# EAGLE design lipovsky-power (EAGLE 7.7.0)
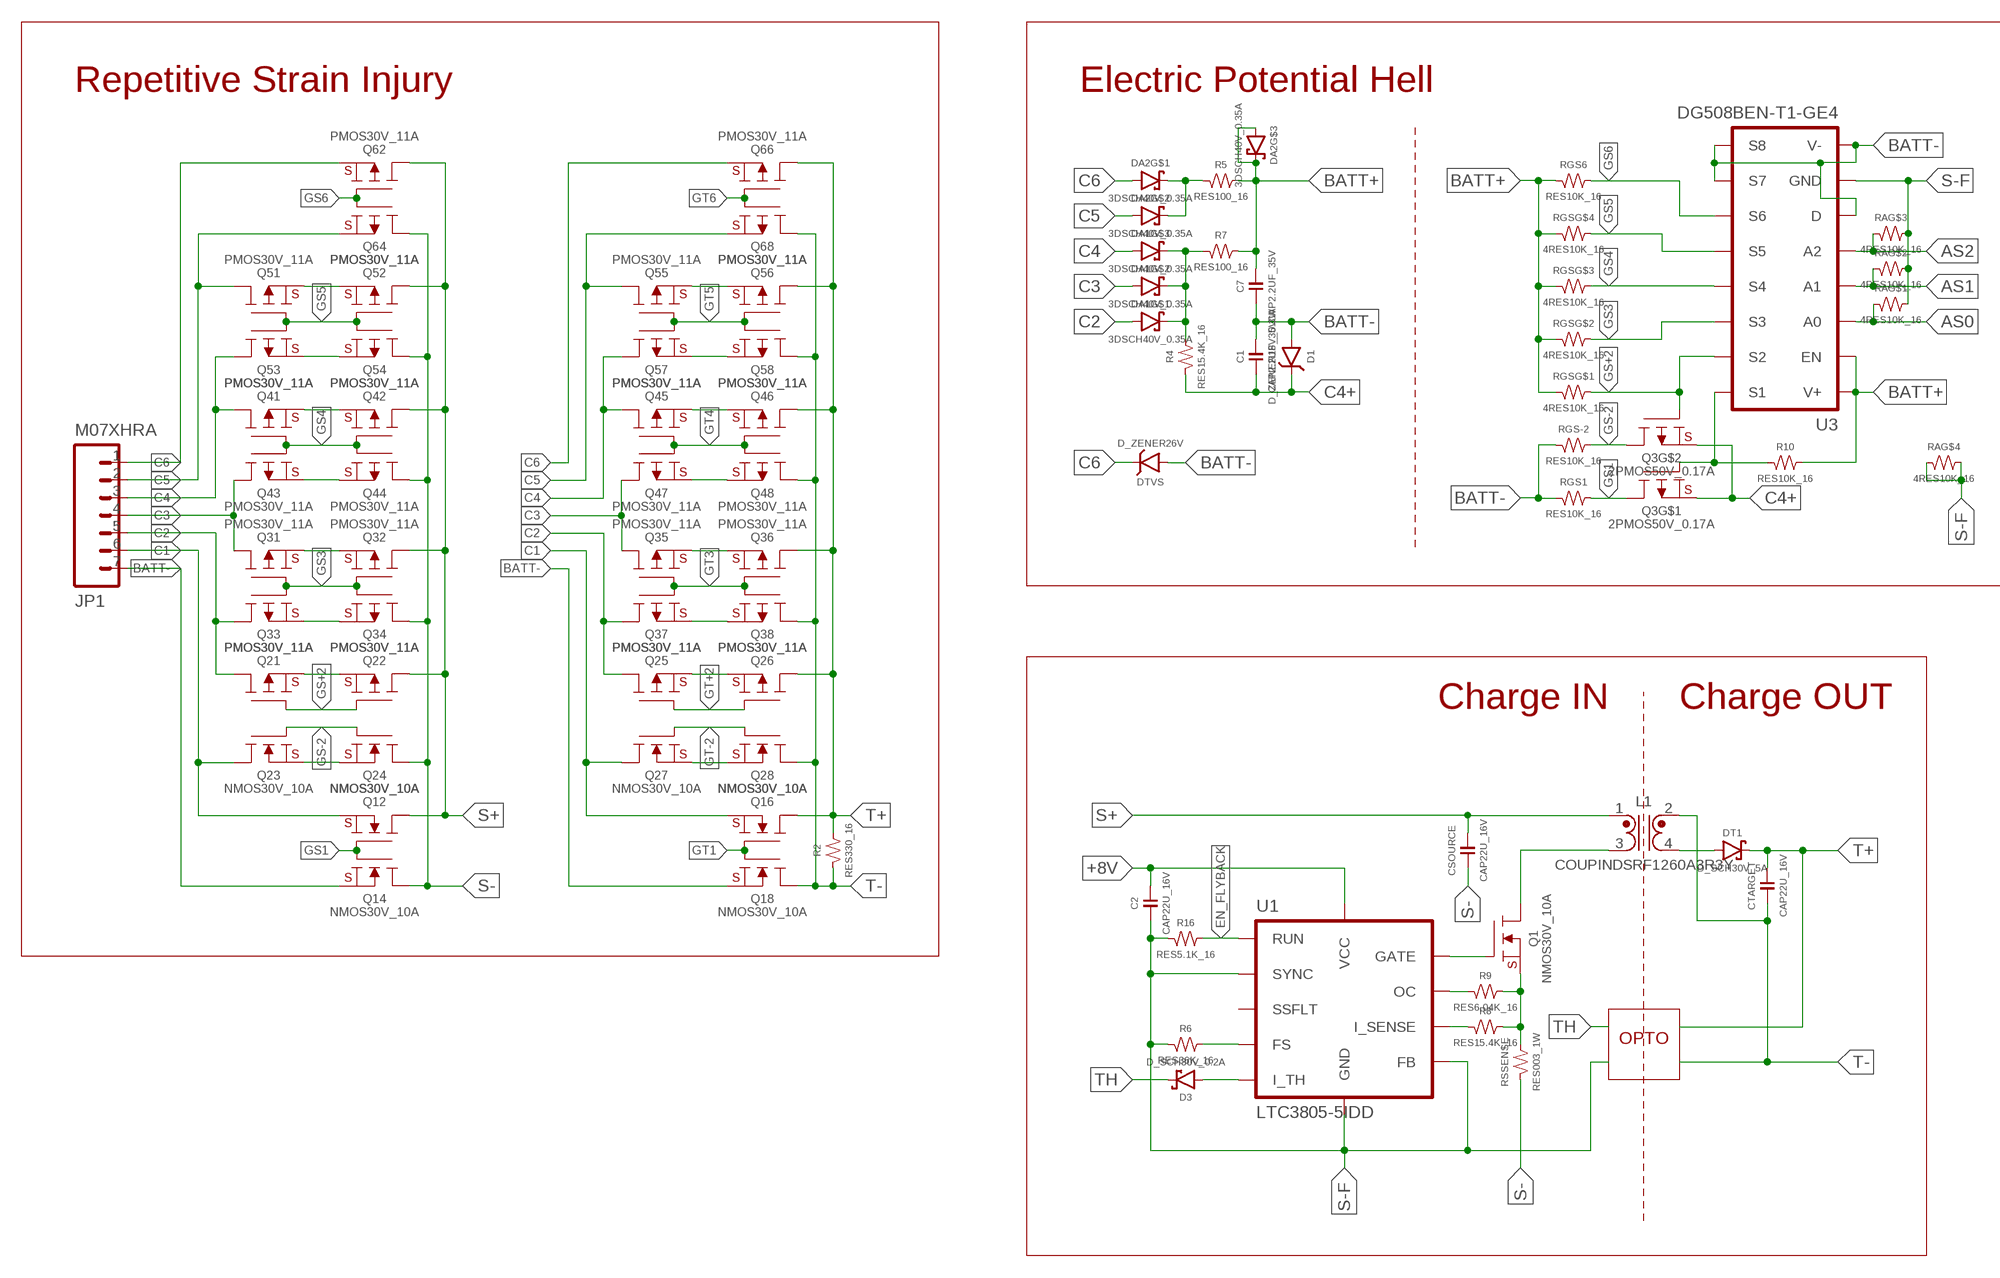
[diagram p0: schematic, sheet 1, part 1 of 2]
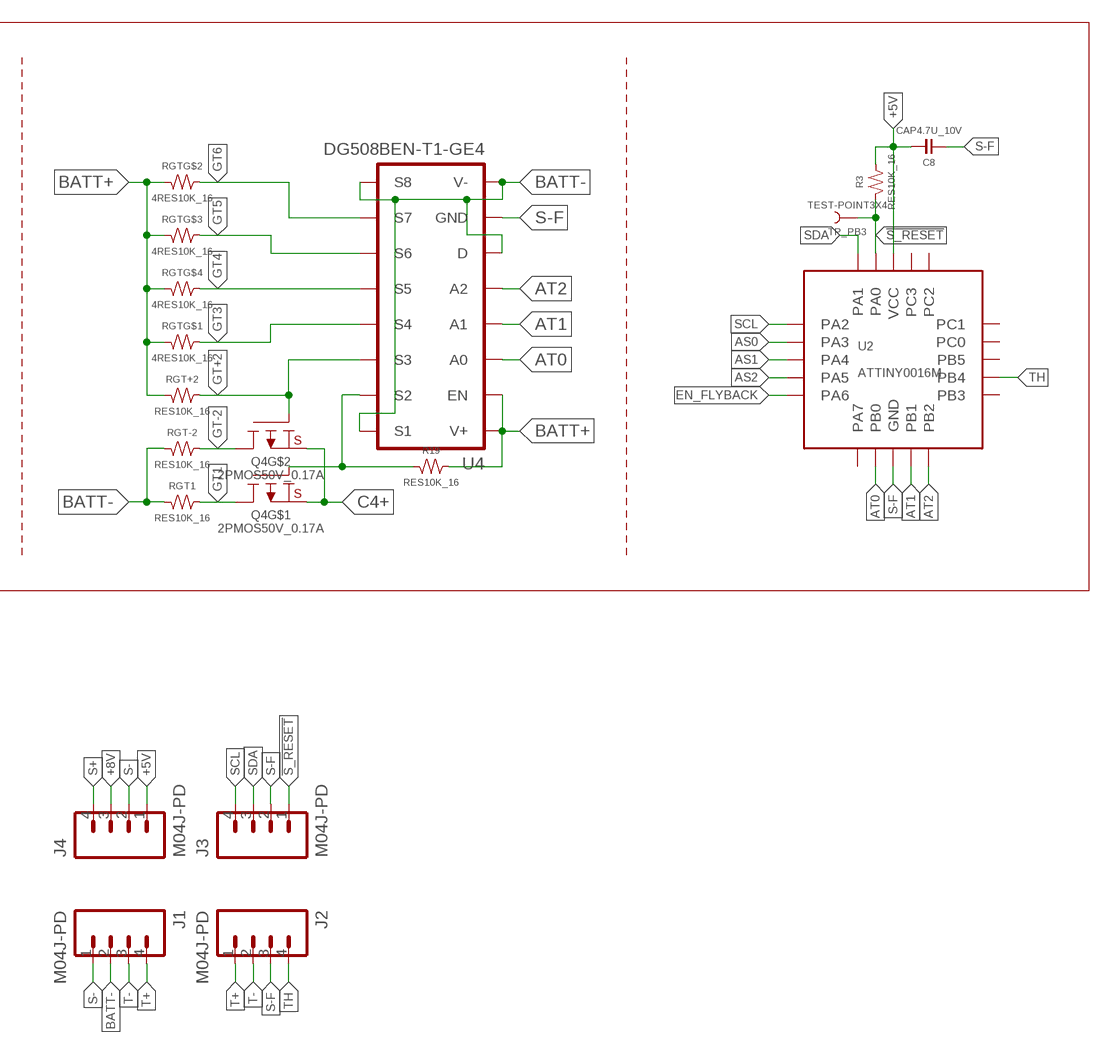
[diagram p1: schematic, sheet 1, part 2 of 2]

## Parts
C1  CAP2.2UF_35V  [0402]
C2  CAP22U_16V  [0805]
C7  CAP2.2UF_35V  [0402]
C8  CAP4.7U_10V  [0603]
CSOURCE  CAP22U_16V  [0805]
CTARGET  CAP22U_16V  [0805]
D1  D_ZENER18V_0.3W  [SOD323+]
D3  D_SCH30V_0.2A  [SOD523+]
DA1  3DSCH40V_0.35A  [SOT-363]
DA2  3DSCH40V_0.35A  [SOT-363]
DT1  D_SCH30V_5A  [SOD-128]
DTVS  D_ZENER26V  [2-UDFN]
J1  M04J-PD  [1X04_929J]
J2  M04J-PD  [1X04_929J]
J3  M04J-PD  [1X04_929J]
J4  M04J-PD  [1X04_929J]
JP1  M07XHRA  [XH07-RA]
L1  COUPINDSRF1260A3R3Y  [SRF1260A]
Q1  NMOS30V_10A  [6-POWERWDFN]
Q3  2PMOS50V_0.17A  [SOT-666]
Q4  2PMOS50V_0.17A  [SOT-666]
Q12  NMOS30V_10A  [6-POWERWDFN]
Q14  NMOS30V_10A  [6-POWERWDFN]
Q16  NMOS30V_10A  [6-POWERWDFN]
Q18  NMOS30V_10A  [6-POWERWDFN]
Q21  PMOS30V_11A  [6-POWERWDFN]
Q22  PMOS30V_11A  [6-POWERWDFN]
Q23  NMOS30V_10A  [6-POWERWDFN]
Q24  NMOS30V_10A  [6-POWERWDFN]
Q25  PMOS30V_11A  [6-POWERWDFN]
Q26  PMOS30V_11A  [6-POWERWDFN]
Q27  NMOS30V_10A  [6-POWERWDFN]
Q28  NMOS30V_10A  [6-POWERWDFN]
Q31  PMOS30V_11A  [6-POWERWDFN]
Q32  PMOS30V_11A  [6-POWERWDFN]
Q33  PMOS30V_11A  [6-POWERWDFN]
Q34  PMOS30V_11A  [6-POWERWDFN]
Q35  PMOS30V_11A  [6-POWERWDFN]
Q36  PMOS30V_11A  [6-POWERWDFN]
Q37  PMOS30V_11A  [6-POWERWDFN]
Q38  PMOS30V_11A  [6-POWERWDFN]
Q41  PMOS30V_11A  [6-POWERWDFN]
Q42  PMOS30V_11A  [6-POWERWDFN]
Q43  PMOS30V_11A  [6-POWERWDFN]
Q44  PMOS30V_11A  [6-POWERWDFN]
Q45  PMOS30V_11A  [6-POWERWDFN]
Q46  PMOS30V_11A  [6-POWERWDFN]
Q47  PMOS30V_11A  [6-POWERWDFN]
Q48  PMOS30V_11A  [6-POWERWDFN]
Q51  PMOS30V_11A  [6-POWERWDFN]
Q52  PMOS30V_11A  [6-POWERWDFN]
Q53  PMOS30V_11A  [6-POWERWDFN]
Q54  PMOS30V_11A  [6-POWERWDFN]
Q55  PMOS30V_11A  [6-POWERWDFN]
Q56  PMOS30V_11A  [6-POWERWDFN]
Q57  PMOS30V_11A  [6-POWERWDFN]
Q58  PMOS30V_11A  [6-POWERWDFN]
Q62  PMOS30V_11A  [6-POWERWDFN]
Q64  PMOS30V_11A  [6-POWERWDFN]
Q66  PMOS30V_11A  [6-POWERWDFN]
Q68  PMOS30V_11A  [6-POWERWDFN]
R2  RES330_16  [0402]
R3  RES10K_16  [0402]
R4  RES15.4K_16  [0402]
R5  RES100_16  [0402]
R6  RES36K_16  [0402]
R7  RES100_16  [0402]
R8  RES15.4K_16  [0402]
R9  RES6.04K_16  [0402]
R10  RES10K_16  [0402]
R16  RES5.1K_16  [0402]
R19  RES10K_16  [0402]
RA  4RES10K_16  [1206-QUAD-LS]
RGS  4RES10K_16  [1206-QUAD-LS]
RGS1  RES10K_16  [0402]
RGS6  RES10K_16  [0402]
RGS-2  RES10K_16  [0402]
RGT  4RES10K_16  [1206-QUAD-LS]
RGT1  RES10K_16  [0402]
RGT+2  RES10K_16  [0402]
RGT-2  RES10K_16  [0402]
RSSENSE  RES003_1W  [1206]
TP_PB3  TEST-POINT3X4  [PAD.03X.04]
U1  LTC3805-5IDD  [10-WFDFN]
U2  ATTINY0016M  [20-VQFN-2]
U3  DG508BEN-T1-GE4  [MINIQFN-16L]
U4  DG508BEN-T1-GE4  [MINIQFN-16L]

## Nets
!GS1: Q3.2(G) R10.1 U3.2(S1)
!GT1: Q4.2(G) R19.1 U4.3(S2)
!S_RESET: J3.1 R3.1 TP_PB3.P$1 U2.19(PA0)
+5V: C8.2 J4.1 R3.2 U2.4(VCC)
+8V: C2.2 J4.3 U1.7(VCC)
AS0: RA.1 U2.2(PA3) U3.15(A0)
AS1: RA.2 U2.5(PA4) U3.14(A1)
AS2: RA.3 U2.6(PA5) U3.13(A2)
AT0: U2.14(PB0) U4.15(A0)
AT1: U2.13(PB1) U4.14(A1)
AT2: U2.12(PB2) U4.13(A2)
BATT+: C7.2 DA2.3(C) DA2.4(A) R5.2 R7.2 R10.2 R19.2 RGS6.1 RGS.1 RGS.2 RGS.3 RGS.4 RGT+2.1 RGT.1 RGT.2 RGT.3 RGT.4 U3.11(V+) U3.16(EN) U4.11(V+) U4.16(EN)
BATT-: C1.2 C7.1 D1.A DTVS.A J1.2 JP1.7 Q14.S Q18.S RGS1.1 RGS-2.1 RGT1.1 RGT-2.1 U3.1(V-) U3.6(D) U3.7(S8) U3.8(S7) U4.1(V-) U4.2(S1) U4.6(D) U4.7(S8)
C1: JP1.6 Q12.S Q16.S Q23.D Q27.D
C2: DA1.6(A) JP1.5 Q21.D Q25.D Q33.D Q37.D
C3: DA1.5(A) JP1.4 Q31.D Q35.D Q43.D Q47.D
C4: DA1.4(A) JP1.3 Q41.D Q45.D Q53.D Q57.D
C4+: C1.1 D1.C Q3.1(S) Q3.4(S) Q4.1(S) Q4.4(S) R4.1
C4D: DA1.1(C) DA1.2(C) DA1.3(C) R4.2 R7.1
C5: DA2.5(A) JP1.2 Q51.D Q55.D Q64.S Q68.S
C6: DA2.6(A) DTVS.C JP1.1 Q62.S Q66.S
C6D: DA2.1(C) DA2.2(C) R5.1
EN_FLYBACK: R16.2 U1.4(RUN) U2.7(PA6)
FS: R6.2 U1.5(FS)
GATE: Q1.G U1.6(GATE)
GS1: Q3.6(D) Q12.G Q14.G RGS1.2
GS3: Q31.G Q32.G Q33.G Q34.G RGS.7 U3.4(S3)
GS4: Q41.G Q42.G Q43.G Q44.G RGS.6 U3.5(S4)
GS5: Q51.G Q52.G Q53.G Q54.G RGS.5 U3.10(S5)
GS6: Q62.G Q64.G RGS6.2 U3.9(S6)
GS+2: Q3.5(G) Q21.G Q22.G RGS.8 U3.3(S2)
GS-2: Q3.3(D) Q23.G Q24.G RGS-2.2
GT1: Q4.6(D) Q16.G Q18.G RGT1.2
GT3: Q35.G Q36.G Q37.G Q38.G RGT.8 U4.5(S4)
GT4: Q45.G Q46.G Q47.G Q48.G RGT.5 U4.10(S5)
GT5: Q55.G Q56.G Q57.G Q58.G RGT.6 U4.9(S6)
GT6: Q66.G Q68.G RGT.7 U4.8(S7)
GT+2: Q4.5(G) Q25.G Q26.G RGT+2.2 U4.4(S3)
GT-2: Q4.3(D) Q27.G Q28.G RGT-2.2
I_SENSE: R8.1 U1.9(I_SENSE)
I_TH: D3.A U1.2(I_TH)
N$7: DT1.A L1.4(B2)
N$10: L1.3(A2) Q1.D
OC: R9.1 U1.8(OC)
S+: CSOURCE.2 J4.4 L1.1(A1) Q12.D Q22.D Q32.D Q42.D Q52.D Q62.D
S-: CSOURCE.1 J1.1 J4.2 Q14.D Q24.D Q34.D Q44.D Q54.D Q64.D RSSENSE.1
S-F: C2.1 C8.1 J2.3 J3.2 R6.1 R16.1 RA.4 RA.5 RA.6 RA.7 RA.8 U1.3(FB) U1.10(SYNC) U1.PAD(GND) U2.3(GND) U2.PAD(GND) U3.12(GND) U4.12(GND)
SCL: J3.4 U2.1(PA2)
SDA: J3.3 U2.20(PA1)
SENSE: Q1.S R8.2 R9.2 RSSENSE.2
SS+2: Q21.S Q22.S
SS+3: Q31.S Q32.S
SS+4: Q41.S Q42.S
SS+5: Q51.S Q52.S
SS-2: Q23.S Q24.S
SS-3: Q33.S Q34.S
SS-4: Q43.S Q44.S
SS-5: Q53.S Q54.S
ST+2: Q25.S Q26.S
ST+3: Q35.S Q36.S
ST+4: Q45.S Q46.S
ST+5: Q55.S Q56.S
ST-2: Q27.S Q28.S
ST-3: Q37.S Q38.S
ST-4: Q47.S Q48.S
ST-5: Q57.S Q58.S
T+: CTARGET.2 DT1.C J1.4 J2.1 Q16.D Q26.D Q36.D Q46.D Q56.D Q66.D R2.2
T-: CTARGET.1 J1.3 J2.2 L1.2(B1) Q18.D Q28.D Q38.D Q48.D Q58.D Q68.D R2.1
TH: D3.C J2.4 U2.10(PB4)
Unconnected: U1.1(SSFLT) U2.8(PA7) U2.9(PB5) U2.11(PB3) U2.15(PC0) U2.16(PC1) U2.17(PC2) U2.18(PC3)

## Notes on the sheet
- Repetitive Strain Injury | Electric Potential Hell
- Charge IN | Charge OUT
- OPTO

## Library data of the parts
C1 C7 = dubec:CAP: Ceramic capacitor; DIGIKEY_PART_#: 445-9028-1-ND; EURO: 12.88/100; MANUFACTURER: TDK Corporation; MFG_PART_#: C1005X5R1V225K050BC; TEMP: X5R; TOLERANCE: ±10%
C2 CSOURCE CTARGET = dubec:CAP: Ceramic capacitor; DIGIKEY_PART_#: 1276-6780-1-ND; EURO: 8.45/100; MANUFACTURER: Samsung Electro-Mechanics America, Inc.; MFG_PART_#: CL21A226MOCLRNC; TEMP: X5R; TOLERANCE: ±20%
C8 = dubec:CAP: Ceramic capacitor; DIGIKEY_PART_#: 587-1441-1-ND; EPK: 29.92; MANUFACTURER: Taiyo Yuden; MFG_PART_#: LMK107BJ475KA-T; TEMP: X5R
D1 = dubec:D_ZENER: Zener diode; DIGIKEY_PART_#: MM3Z18VT1GOSCT-ND; IR: 50nA @ 12.6V; MANUFACTURER: ON Semiconductor; MFG_PART_#: MM3Z18VT1G; TOLERANCE: ±6%; Z: 45 Ohm
D3 = dubec:D_SCH: Schottky diode; DIGIKEY_PART_#: RB531SM-30T2RCT-ND; EURO: 8.89/100; MANUFACTURER: Rohm Semiconductor; MFG_PART_#: RB531SM-30T2R; V_FWD: 350mV @ 10mA
DA1 DA2 = dubec:3DSCH; DIGIKEY_PART_#: SD103ATW-FDICT-ND; EPK: 87.43; MANUFACTURER: Diodes Incorporated; MFG_PART_#: SD103ATW-7-F; VF: 500mV @ 100mA
DT1 = dubec:D_SCH: Schottky diode; DIGIKEY_PART_#: 1727-5317-1-ND; EURO: 27.25/100; IREV: 8mA @ 30V; MANUFACTURER: Nexperia USA Inc.; MFG_PART_#: PMEG3050EP,115; VFWD: 360mV @ 5A
DTVS = dubec:D_ZENER: Zener diode; DIGIKEY_PART_#: D26V0H1U2LP20-7DICT-ND; EURO: 20.16/100; MANUFACTURER: Diodes Incorporated; MFG_PART_#: D26V0H1U2LP20-7; PP: 300W; V_BRDN: 28V; V_CLAMP: 40V
J1-J4 = dubec:M04; DIGIKEY_PART_#: 801-87-004-10-012101-ND; EURO: 23.70/100; MANUFACTURER: Preci-Dip; MFG_PART_#: 801-87-004-10-012101; MOUSER_PART_#: 437-8018700410012101
JP1 = dubec:M07; DIGIKEY_PART_#: 455-2240-ND; EPK: 190.44; MANUFACTURER: JST Sales America Inc.; MFG_PART_#: S7B-XH-A(LF)(SN)
L1 = dubec:COUPIND: Dual-Winding (Coupled) Power Inductor; DIGIKEY_PART_#: SRF1260A-3R3YCT-ND; EURO: 1.07; LPAR: 3.3uH; MANUFACTURER: Bourns Inc.; MFG_PART_#: SRF1260A-3R3Y; RPAR: 10.1mOhm; TOLERANCE: ±30%
Q1 Q12 Q14 Q16 Q18 Q23 Q24 Q27 Q28 = dubec:NMOS: N-channel MOSFET; DIGIKEY_PART_#: FDMA7670CT-ND; EPK: 231.24; MANUFACTURER: Fairchild Semiconductor; MFG_PART_#: FDMA7670; POWER: 0.9W; RDS: 15 mOhm @ 11A, 10V
Q3 Q4 = dubec:2PMOS: Dual P-channel enhancement mode MOSFET; DIGIKEY_PART_#: 568-10474-1-ND; EPK: 103.10; MANUFACTURER: NXP Semiconductors; MFG_PART_#: BSS84AKV,115; POWER: 0.5W; RDS: 7.5 Ohm @ 100mA, 10V; TEMP: -55°C ~ 150°C (TJ)
Q21 Q22 Q25 Q26 Q31-Q38 Q41-Q48 Q51-Q58 Q62 Q64 Q66 Q68 = dubec:PMOS: Single P-Channel MOSFET; ALTERNATIVE: SIA483DJ-T1-GE3; DIGIKEY_PART_#: FDMA6676PZCT-ND; EPK: 316.51; MANUFACTURER: Fairchild Semiconductor; MFG_PART_#: FDMA6676PZ; POWER: 0.9W; RDS: 13.5 mOhm @ 11A, 10V
R2 = dubec:RES: Resistor; DIGIKEY_PART_#: 541-330LCT-ND; EPK: 5.24; MANUFACTURER: Vishay Dale; MFG_PART_#: CRCW0402330RFKED; TEMP: ±100ppm/°C; TOLERANCE: ±1%
R3 R10 R19 RGS1 RGS6 RGS-2 RGT1 RGT+2 RGT-2 = dubec:RES: Resistor; DIGIKEY_PART_#: 541-10.0KLCT-ND; EPK: 5.24; MANUFACTURER: Vishay Dale; MFG_PART_#: CRCW040210K0FKED; TEMP: ±100ppm/°C; TOLERANCE: ±1%
R4 R8 = dubec:RES: Resistor; DIGIKEY_PART_#: 541-15.4KLCT-ND; EPK: 5.24; MANUFACTURER: Vishay Dale; MFG_PART_#: CRCW040215K4FKED; TEMP: ±100ppm/°C; TOLERANCE: ±1%
R5 R7 = dubec:RES: Resistor; DIGIKEY_PART_#: 541-100LCT-ND; EURO: 2.01/50; MANUFACTURER: Vishay Dale; MFG_PART_#: CRCW0402100RFKED; TEMP: ±100ppm/°C; TOLERANCE: ±1%
R6 = dubec:RES: Resistor; DIGIKEY_PART_#: 541-36.0KLCT-ND; EURO: 5.69/1000; MANUFACTURER: Vishay Dale; MFG_PART_#: CRCW040236K0FKED; TEMP: ±100ppm/°C; TOLERANCE: ±1%
R9 = dubec:RES: Resistor; DIGIKEY_PART_#: 541-6.04KLCT-ND; EPK: 5.24; MANUFACTURER: Vishay Dale; MFG_PART_#: CRCW04026K04FKED; TEMP: ±100ppm/°C; TOLERANCE: ±1%
R16 = dubec:RES: Resistor; DIGIKEY_PART_#: 541-5.10KLCT-ND; EPK: 5.24; MANUFACTURER: Vishay Dale; MFG_PART_#: CRCW04025K10FKED; TEMP: ±100ppm/°C; TOLERANCE: ±1%
RA RGS RGT = dubec:4RES; DIGIKEY_PART_#: Y9103CT-ND; EPK: 11.22; MANUFACTURER: Panasonic Electronic Components; MFG_PART_#: EXB-38V103JV; TEMP: ±200ppm/°C; TOLERANCE: ±5%
RSSENSE = dubec:RES: Resistor; DIGIKEY_PART_#: CSNL1206FT3L00CT-ND; EPK: 190.34; MANUFACTURER: Stackpole Electronics Inc.; MFG_PART_#: CSNL1206FT3L00; TEMP: ±50ppm/°C; TOLERANCE: ±1%
TP_PB3 = SparkFun-Passives:TEST-POINT: Bare copper test points for troubleshooting or ICT
U1 = dubec:LTC3805-5: LTC3805-5 - Adjustable Frequency Current Mode Flyback/ Boost/SEPIC DC/DC Controller; DIGIKEY_PART_#: LTC3805IDD-5#PBF-ND; EPK: 1609.00; MANUFACTURER: Linear Technology; MFG_PART_#: LTC3805IDD-5#PBF; TEMP: -40°C ~ 125°C (TJ)
U2 = dubec:ATTINY0016: AVR® 8-bit CPU; DIGIKEY_PART_#: ATTINY1616-MFRCT-ND; EEPROM: 256; EURO: 15.52/25; FLASH: 16KB; MANUFACTURER: Microchip Technology; MFG_PART_#: ATTINY1616-MFR; RAM: 2K; TEMP: -40°C ~ 125°C (TA)
U3 U4 = dubec:DG508B: Vishay Siliconix DG508B - 8-Channel CMOS Analog Multiplexer; EPK: 977.00; MANUFACTURER: Vishay Siliconix; MFG_PART_#: DG508BEN-T1-GE4; MOUSER_PART_#: 78-DG508BEN-T1-GE4; RON: 380 Ohm; TEMP: -40°C ~ 125°C (TA); VSS: ±5 V ~ 20 V

## Board
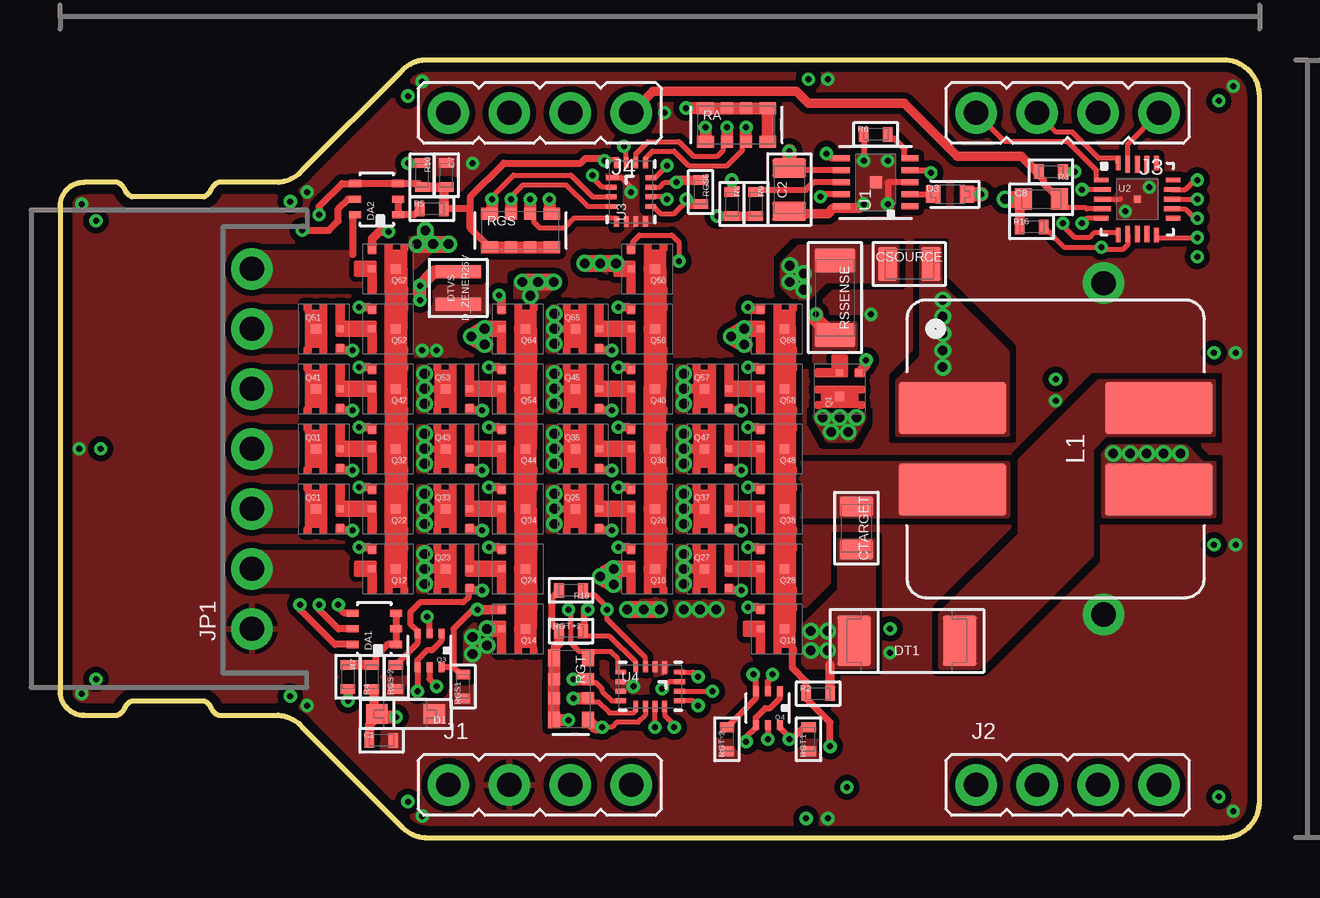
[diagram p2: board, top side]
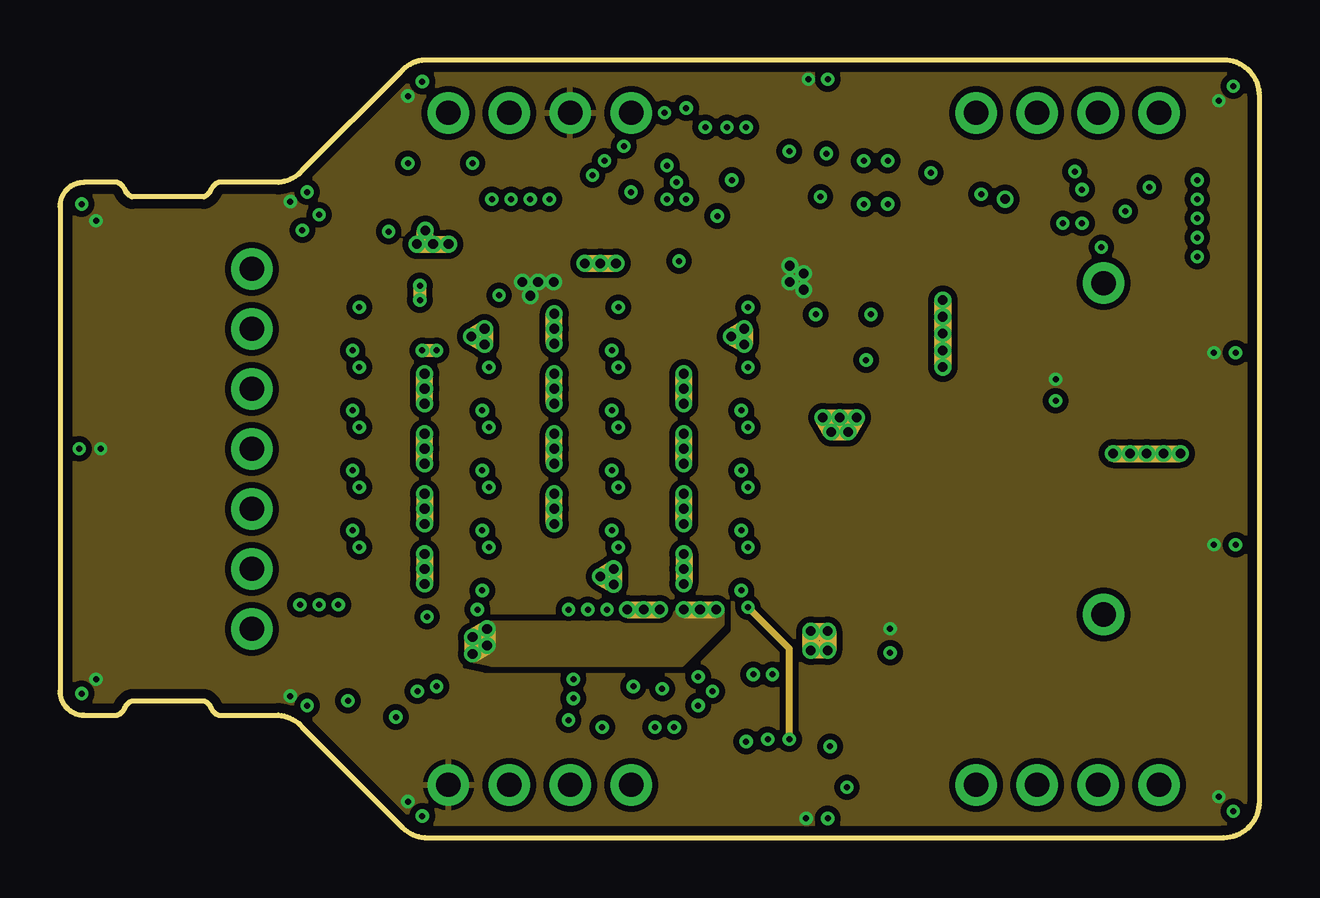
[diagram p3: board, inner layer Route2]
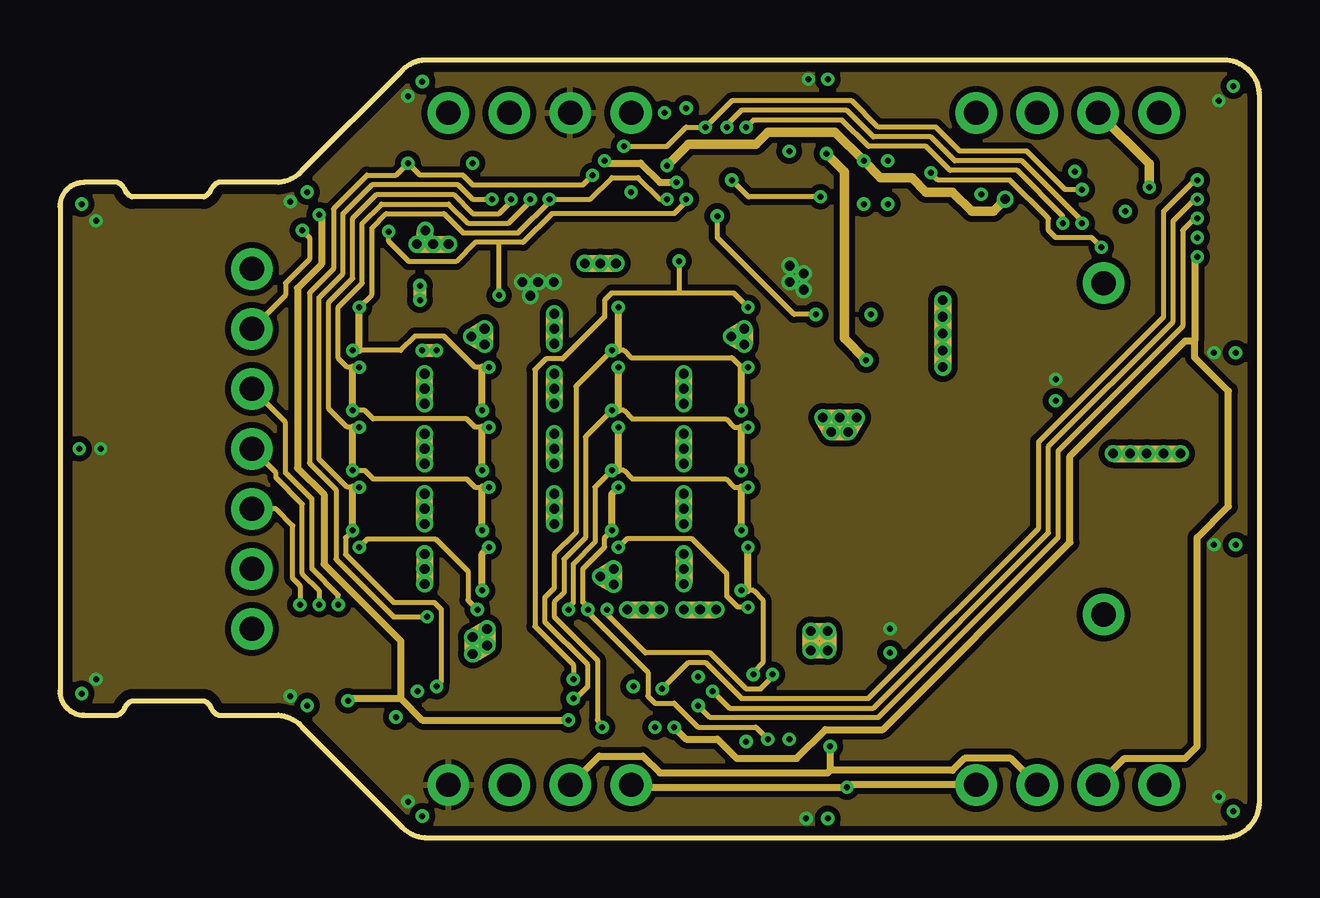
[diagram p4: board, inner layer Route15]
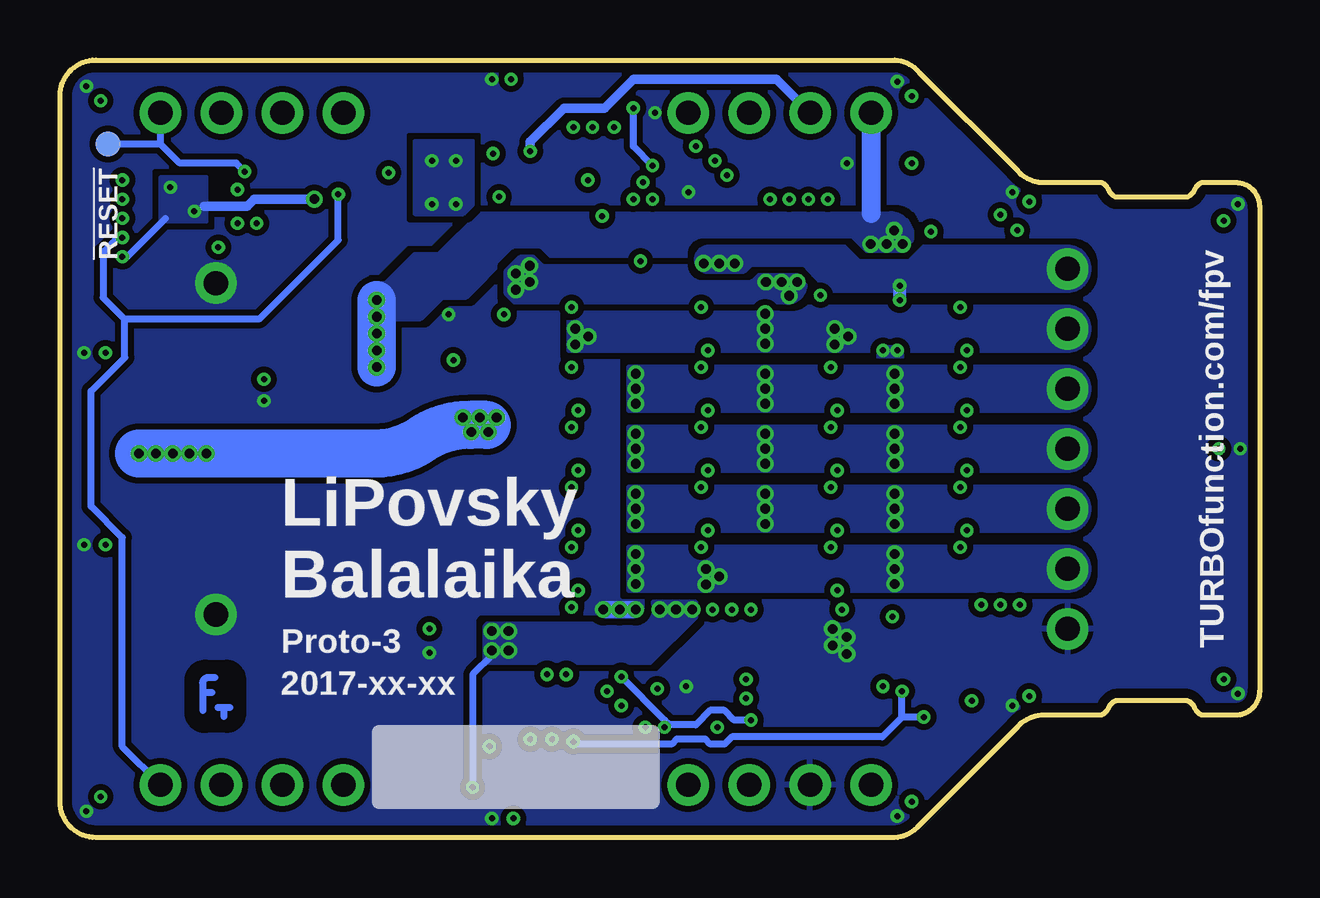
[diagram p5: board, bottom side, seen from below]

Size 50 x 32.4 mm. Coordinates in mm from the lower left corner, seen from the top.
Outline: 0,6.1 arc90 1,5.1 2.4,5.1 arc45 2.7,5.4 arc-45 3,5.7 6,5.7 arc-45 6.3,5.4 arc45 6.6,5.1 9.1,5.1 arc-45 10.1,4.6 14.2,0.5 arc45 15.2,0 48.5,0 arc90 50,1.5 50,30.9 arc90 48.5,32.4 15.2,32.4 arc45 14.2,31.9 10.1,27.8 arc-45 9.1,27.3 6.6,27.3 arc45 6.3,27 arc-45 6,26.7 3,26.7 arc-45 2.7,27 arc45 2.4,27.3 1,27.3 arc90 0,26.3 0,6.1
Copper layers (1+2*15+16): Top 1mil / dielectric 0.2mm / Route2 0.5mil / dielectric 1.2mm / Route15 0.5mil / dielectric 0.2mm / Bottom 1mil
Design rules "lipovsky-power *": minimum track width 0.15mm, minimum drill 0.25mm, track to track 0.2mm, track to pad 0.2mm, pad to pad 0.2mm, via to via 0.2mm, smd to smd 0mil, copper to edge 0.4mm, drill to drill 0.2mm, minimum pad ring 0.15mm, minimum via ring 0.15mm, stop-mask expansion 0.01mm, vias tented up to drill 0.5mm, thermal gap 0.2mm

### Footprints (pad centres in the part's own frame; a part is rotated, then mirrored left to right if it is on the bottom)
0402 = smd 0.4 x 0.6: 1 -0.5,0; 2 0.5,0
0805 = smd 0.8 x 1.4: 1 -0.9,0; 2 0.9,0
0603 = smd 0.7 x 0.9: 1 -0.75,0; 2 0.75,0
SOD323+ = smd 0.9 x 0.8: A -1.2,0; C 1.2,0
SOD523+ = smd 0.6 x 0.7: A -0.7,0; C 0.7,0
SOT-363 = smd 0.3 x 0.5: 1 -0.65,-0.9; 2 0,-0.9; 3 0.65,-0.9; 4 0.65,0.9; 5 0,0.9; 6 -0.65,0.9
SOD-128 = smd 1.4 x 2.1: A -2.2,0; C 2.2,0
2-UDFN = smd 0.55 x 1.9: A -0.675,0; C 0.675,0
1X04_929J = drill 1.016: 1 -3.81,0; 2 -1.27,0; 3 1.27,0; 4 3.81,0
XH07-RA = drill 1.016: 1 7.5,0; 2 5,0; 3 2.5,0; 4 0,0; 5 -2.5,0; 6 -5,0; 7 -7.5,0
SRF1260A = smd 2.15 x 4.5: 1 -1.7,-4.3; 2 1.7,-4.3; 3 1.7,4.3; 4 -1.7,4.3
6-POWERWDFN = smd 0.4 x 0.4: D -0.325,0 | smd 0.3 x 0.3: G 0.675,-0.8; S 0.675,0
SOT-666 = smd 0.25 x 0.4: 1 -0.5,-0.7; 2 0,-0.7; 3 0.5,-0.7; 4 0.5,0.7; 5 0,0.7; 6 -0.5,0.7
1206-QUAD-LS = smd 0.7 x 0.5: 1 -1.3,-0.7; 4 1.3,-0.7; 5 1.3,0.7; 8 -1.3,0.7 | smd 0.5 x 0.5: 2 -0.4,-0.7; 3 0.4,-0.7; 6 0.4,0.7; 7 -0.4,0.7
1206 = smd 1 x 1.7: 1 -1.55,0; 2 1.55,0
PAD.03X.04 = smd 1.016 x 1.016: P$1 0,0
10-WFDFN = smd 0.25 x 0.7: 1 -1,-1.425; 2 -0.5,-1.425; 3 0,-1.425; 4 0.5,-1.425; 5 1,-1.425; 6 1,1.425; 7 0.5,1.425; 8 0,1.425; 9 -0.5,1.425; 10 -1,1.425 | smd 0.5 x 0.5: PAD 0,0
20-VQFN-2 = smd 0.6 x 0.2: 1 -1.5,0.8; 5 -1.5,-0.8; 11 1.5,-0.8; 15 1.5,0.8 | smd 0.7 x 0.2: 2 -1.45,0.4; 3 -1.45,0; 4 -1.45,-0.4; 12 1.45,-0.4; 13 1.45,0; 14 1.45,0.4 | smd 0.2 x 0.6: 6 -0.8,-1.5; 10 0.8,-1.5; 16 0.8,1.5; 20 -0.8,1.5 | smd 0.2 x 0.7: 7 -0.4,-1.45; 8 0,-1.45; 9 0.4,-1.45; 17 0.4,1.45; 18 0,1.45; 19 -0.4,1.45 | smd 0.3 x 0.3: PAD 0,0
MINIQFN-16L = smd 0.55 x 0.2: 1 -0.775,0.6 | smd 0.45 x 0.2: 2 -0.825,0.2; 3 -0.825,-0.2; 4 -0.825,-0.6; 9 0.825,-0.6; 10 0.825,-0.2; 11 0.825,0.2; 12 0.825,0.6 | smd 0.2 x 0.45: 5 -0.6,-1.225; 6 -0.2,-1.225; 7 0.2,-1.225; 8 0.6,-1.225; 13 0.6,1.225; 14 0.2,1.225; 15 -0.2,1.225; 16 -0.6,1.225

### Placement (x,y rotation side)
ART1  [TF-EMBLEM]  43.5,5.9 0 bottom
C1  13.4,4.05 0 top
C2  30.4,27 90 top
C7  16.1,27.6 270 top
C8  40.9,26.6 0 top
CSOURCE  35.4,23.9 0 top
CTARGET  33.2,12.9 270 top
D1  14.4,5.15 180 top
D3  37.1,26.8 0 top
DA1  13.1,8.7 90 top
DA2  13.2,26.6 90 top
DT1  35.3,8.2 180 top
DTVS  16.6,22.9 90 top
J1  20,2.2 0 top
J2  42,2.2 0 top
J3  42,30.2 180 top
J4  20,30.2 180 top
JP1  8,16.2 90 top
L1  41.5,16.2 270 top
Q1  32.5,18.7 90 top
Q3  15.4,7.8 180 top
Q4  29.5,5.4 180 top
Q12  13.68,11.2 180 top
Q14  19.07,8.7 180 top
Q16  24.48,11.2 180 top
Q18  29.88,8.7 180 top
Q21  11,13.7 0 top
Q22  13.68,13.7 180 top
Q23  16.4,11.2 0 top
Q24  19.07,11.2 180 top
Q25  21.8,13.7 0 top
Q26  24.48,13.7 180 top
Q27  27.2,11.2 0 top
Q28  29.88,11.2 180 top
Q31  11,16.2 0 top
Q32  13.68,16.2 180 top
Q33  16.4,13.7 0 top
Q34  19.07,13.7 180 top
Q35  21.8,16.2 0 top
Q36  24.48,16.2 180 top
Q37  27.2,13.7 0 top
Q38  29.88,13.7 180 top
Q41  11,18.7 0 top
Q42  13.68,18.7 180 top
Q43  16.4,16.2 0 top
Q44  19.07,16.2 180 top
Q45  21.8,18.7 0 top
Q46  24.48,18.7 180 top
Q47  27.2,16.2 0 top
Q48  29.88,16.2 180 top
Q51  11,21.2 0 top
Q52  13.68,21.2 180 top
Q53  16.4,18.7 0 top
Q54  19.07,18.7 180 top
Q55  21.8,21.2 0 top
Q56  24.48,21.2 180 top
Q57  27.2,18.7 0 top
Q58  29.88,18.7 180 top
Q62  13.68,23.7 180 top
Q64  19.07,21.2 180 top
Q66  24.48,23.7 180 top
Q68  29.88,21.2 180 top
R2  31.6,6 0 top
R3  41.3,27.75 180 top
R4  13,6.7 90 top
R5  15.5,26.2 0 top
R6  34,29.3 0 top
R7  12,6.7 270 top
R8  28,26.4 270 top
R9  29,26.4 270 top
R10  15.1,27.6 270 top
R16  40.5,25.45 0 top
R19  21.3,10.3 180 top
RA  28.2,29.7 0 top
RGS  19.2,25.3 0 top
RGS1  16.8,6.3 90 top
RGS6  26.7,26.9 270 top
RGS-2  14,6.7 90 top
RGT  21.3,6.2 270 top
RGT1  31.2,4.1 90 top
RGT+2  21.3,8.6 0 top
RGT-2  27.8,4.1 90 top
RSSENSE  32.3,22.5 270 top
TP_PB3  48,28.9 0 bottom
U1  34,27.3 90 top
U2  44.9,26.6 0 top
U3  23.8,26.9 0 top
U4  24.6,6.3 270 top

### Tracks (layer width: path | path; a pad name or v marks a point on that pad's centre or on a via)
!GS1  (via drill 0.25)
  Top 0.2: U3.2 22.6,27.1 22.2,27.5 v22.2,27.6
  Top 0.25: Q3.2 15.4,9.1 v15.3,9.2
  Top 0.4: v14.5,28.1 R10.1
  Route15 0.2: v22.2,27.6 21.8,27.2 17.2,27.2 16.8,27.6 15,27.6 v14.5,28.1 14,27.6 12.8,27.6 11.4,26.2 11.4,23.7 10.4,22.7 10.4,15.6 11.5,14.5 11.5,11.6 13.9,9.2 v15.3,9.2
!GT1  (via drill 0.25)
  Top 0.2: U4.3 24.4,7.5 22.8,9.1 v22.8,9.5 22.8,9.6 22.3,10.1 21.8,10.1 R19.1
  Top 0.25: Q4.2 29.5,6.5 29.7,6.7 v29.7,6.8
  Route15 0.2: v29.7,6.8 29.7,6.7 29.2,6.2 28.6,6.2 27.1,7.7 24.4,7.7 22.8,9.3 v22.8,9.5
!S_RESET  (via drill 0.25)
  Top 0.2: U2.19 44.5,28.89 J3.1
  Top 0.4: R3.1 v42.3,27.75
  Bottom 0.3: v42.3,27.75 42.65,28.1 45.01,28.1 45.81,28.9 | 45.81,28.9 TP_PB3.P$1 | 45.81,28.9 J3.1
+5V
  Top 0.2: U2.4 42.8,26.2 42.75,26.25 42,26.25 C8.2
  Top 0.3: 40.73,27.75 R3.2 40.8,27.6 41,27.4 41,27.25 C8.2
  Top 0.4: 40.73,27.75 40.08,28.4 37.4,28.4 35.2,30.6 31.2,30.6 30.7,31.1 24.71,31.1 J4.1
+8V  (via drill 0.25)
  Top 0.25: U1.7 30.5,27.8 C2.2
  Top 0.6: v30.4,28.6 C2.2
  Bottom 0.4: J4.3 20.13,31.6 26.1,31.6 27.3,30.4 29,30.4 30.4,29 v30.4,28.6
AS0  (via drill 0.25)
  Top 0.2: U3.15 23.6,28.7 v23.5,28.8 | U2.2 v42.6,27
  Top 0.5: v26.9,29.6 RA.1
  Route15 0.2: v23.5,28.8 25.3,28.8 26.1,29.6 v26.9,29.6 28,30.7 33,30.7 34.1,29.6 36.5,29.6 37.5,28.6 40.3,28.6 41.9,27 v42.6,27
AS1  (via drill 0.25)
  Top 0.2: U3.14 24,28.5 24.5,29 25.8,29 26.4,28.4 27.4,28.4 27.65,28.65 27.65,28.85 RA.2 | U2.5 42.8,25.8 v42.6,25.6
  Top 0.5: v27.8,29.6 RA.2
  Route15 0.2: v42.6,25.6 42.6,25.7 40.1,28.2 37.3,28.2 36.3,29.2 33.9,29.2 32.8,30.3 28.4,30.3 27.8,29.7 v27.8,29.6
AS2  (via drill 0.25)
  Top 0.2: U3.13 24.4,28.3 24.7,28.6 25.6,28.6 26.2,28 27.8,28 28.45,28.65 28.45,28.85 RA.3 | U2.6 44.1,25.2 43.1,25.2 42.9,25 42.3,25 41.8,25.5 v41.8,25.6
  Top 0.5: RA.3 v28.6,29.6
  Route15 0.2: v41.8,25.6 41.8,25.9 39.9,27.8 37.1,27.8 36.1,28.8 33.7,28.8 32.6,29.9 28.9,29.9 v28.6,29.6
AT0  (via drill 0.25)
  Top 0.2: U4.15 25.4,6.5 v25.1,6.2 | U2.14 46.9,27 47.3,27.4 v47.4,27.4
  Route15 0.2: v25.1,6.2 26.2,7.3 26.9,7.3 28.4,5.8 33.7,5.8 40.8,12.9 40.8,16.5 46,21.7 46,26.1 47.3,27.4 v47.4,27.4
AT1  (via drill 0.25)
  Top 0.2: U4.14 v27.2,6.1 | U2.13 v47.4,26.6
  Route15 0.2: v27.2,6.1 27.9,5.4 33.9,5.4 41.2,12.7 41.2,16.3 46.4,21.5 46.4,25.7 47.3,26.6 v47.4,26.6
AT2  (via drill 0.25)
  Top 0.2: 25.9,5.7 U4.13 26.4,5.7 v26.6,5.5 | U2.12 46.9,26.2 47.3,25.8 v47.4,25.8
  Route15 0.2: v47.4,25.8 47.3,25.8 46.8,25.3 46.8,21.3 41.6,16.1 41.6,12.5 34.1,5 27.1,5 v26.6,5.5
BATT+  (via drill 0.25)
  Top 0.2: v24.8,4.6 U4.11 | U4.16 26.4,6.9 v26.6,6.7 | U3.11 25,27.1 25.2,27.3 v25.7,27.3 | v22.7,28.2 22.75,28.25 23.2,28.25 U3.16
  Top 0.3: v22.7,28.2 22.6,28.3 21.9,28.3 21.7,28.1 18.5,28.1 17.1,26.7 17.1,26.2 | v10.8,25.95 10.8,26.3 11.75,27.25 DA2.4 DA2.3 14.95,27.25 R10.2 | RGS.1 17.1,25.4 17.1,26.2 | RGT+2.1 20.5,8.9 20.5,10 R19.2 | 17.1,26.2 R5.2
  Top 0.4: RGT.1 20.65,7.55 20.65,7.95 20.8,8.1 RGT+2.1 | R5.2 16,27 C7.2 R10.2 | R7.2 v12,5.7 | RGS6.1 25.8,27.4 v25.7,27.3
  Top 0.5: RGS.1 RGS.2 RGS.3 RGS.4 | RGT.1 RGT.2 RGT.3 RGT.4 v21.2,4.9
  Route15 0.3: v25.7,27.3 25,27.3 24.2,28.1 22.8,28.1 v22.7,28.2 | v10.8,25.95 10.9,25.85 10.9,23.9 9.9,22.9 9.9,15.4 11,14.3 11,11.4 14.2,8.2 14.2,5.8 | v21.2,4.9 15.1,4.9 14.2,5.8 | v12,5.7 12.1,5.8 14.2,5.8
  Bottom 0.3: v21.2,4.9 21.9,4.9 22.3,5.3 22.9,5.3 23.5,4.7 24.6,4.7 24.8,4.9 | 24.8,4.9 v26.6,6.7 | v24.8,4.6 24.8,4.9
BATT-  (via drill 0.25, 0.4, 1.02)
  Top 0.2: U3.1 23.4,27.5 23.8,27.1 v23.8,26.9
  Route2 0.55: v15.1,20.3 v15.7,20.3
  Route2 0.7: v26,9.5 v27.35,9.5 | v17.2,8.35 v17.8,8.7 v17.8,8 v17.2,7.65 v17.2,8.35
  Route15 0.55: v15.1,20.3 v15.7,20.3
  Route15 0.7: v26,9.5 v27.35,9.5 | v17.2,8.35 v17.8,8.7 v17.8,8 v17.2,7.65 v17.2,8.35
  Bottom 0.7: v26,9.5 v27.35,9.5
  other vias: 43.5,9.3 43.5,23.1 23.9,6.3 26.68,9.5 32,31.6 33.8,21.8 0.9,26.4 0.9,6 48.9,1.1 48.9,31.3 15.1,31.5 15.1,0.9 0.8,16.2 32,0.8 49,20.2 10.3,5.5 10.3,26.9 17.2,28.1 49,12.2 34.6,7.7 41.5,18.2 25.2,30.2
  pour Top (isolate 0.25, rank 6): 0,0 0,32.9 50.5,32.9 50.5,0
  pour Bottom (isolate 0.25, rank 6): 0,0 0,34.4 52,34.4 52,0
  pour Route2 (no thermals): 17.8,8.95 25.25,8.95 25.8,9.5 27.6,9.5 27.6,8.9 25.9,7.2 18,7.2 17.12,7.4
C1  (via drill 0.4)
  Top 0.4: v15.2,11.2 Q23.D | v26,11.2 Q27.D
  Top 0.7: v22.52,10.88 v23.07,11.2 v23.07,10.55 v22.52,10.88
  Route2 0.7: v15.2,11.82 v15.2,10.57 | v26,11.82 v26,10.57 | v22.52,10.88 v23.07,10.55 v23.07,11.2 v22.52,10.88
  Route15 0.7: v15.2,11.82 v15.2,10.57 | v26,11.82 v26,10.57 | v22.52,10.88 v23.07,10.55 v23.07,11.2 v22.52,10.88
  pour Top: 14.95,10.25 14.95,12.15 15.65,12.15 15.65,10.25
  pour Top: 23.1,10.3 23.1,11.45 23.7,11.45 23.7,10.3
  pour Top: 25.75,10.25 25.75,12.15 26.45,12.15 26.45,10.25
  pour Bottom (isolate 0.25, rank 5, no thermals): 8,12.1 26.3,12.1 26.3,10.3 8,10.3 arc-180
  pour Top (no thermals): 8,10.5 8,11.9 11.8,11.9 12.25,11.45 13,11.45 13,10.5
C2  (via drill 0.25, 0.4)
  Top 0.3: v15.2,13.7 Q33.D | v20.6,13.7 Q25.D | DA1.6 11.45,8.05 10,9.5 v10,9.7
  Top 0.4: v26,13.7 Q37.D
  Route2 0.7: v15.2,14.32 v15.2,13.07 | v20.6,13.07 v20.6,14.32 | v26,13.07 v26,14.32
  Route15 0.2: JP1.5 9,13.7 9.7,13 9.7,10.8 10,10.5 v10,9.7
  Route15 0.7: v15.2,13.07 v15.2,14.32 | v20.6,14.32 v20.6,13.07 | v26,13.07 v26,14.32
  pour Top: 14.95,12.75 14.95,14.65 15.65,14.65 15.65,12.75
  pour Bottom (isolate 0.25, rank 5, no thermals): 8,14.6 26.3,14.6 26.3,12.8 8,12.8 arc-180
  pour Top: 20.35,12.75 20.35,14.65 21.05,14.65 21.05,12.75
  pour Top: 25.75,12.75 25.75,14.65 26.45,14.65 26.45,12.75
  pour Top (no thermals): 8,13 8,14.4 10.7,14.4 10.7,13
C3  (via drill 0.25, 0.4)
  Top 0.3: v15.2,16.2 Q43.D | v20.6,16.2 Q35.D | DA1.5 11.6,8.7 10.8,9.5 v10.8,9.7
  Top 0.4: v26,16.2 Q47.D
  Route2 0.7: v15.2,15.57 v15.2,16.82 | v20.6,15.57 v20.6,16.82 | v26,15.57 v26,16.82
  Route15 0.2: JP1.4 9,15.2 9,15 10.1,13.9 10.1,11 10.8,10.3 v10.8,9.7
  Route15 0.7: v15.2,15.57 v15.2,16.82 | v20.6,16.82 v20.6,15.57 | v26,15.57 v26,16.82
  pour Top: 14.95,15.25 14.95,17.15 15.65,17.15 15.65,15.25
  pour Bottom (isolate 0.25, rank 5, no thermals): 8,17.1 26.3,17.1 26.3,15.3 8,15.3 arc-180
  pour Top: 20.35,15.25 20.35,17.15 21.05,17.15 21.05,15.25
  pour Top: 25.75,15.25 25.75,17.15 26.45,17.15 26.45,15.25
  pour Top (no thermals): 8,15.5 8,16.9 10.7,16.9 10.7,15.5
C4  (via drill 0.25, 0.4)
  Top 0.3: v15.2,18.7 Q53.D | v20.6,18.7 Q45.D | DA1.4 11.85,9.35 11.6,9.6 v11.6,9.7
  Top 0.4: v26,18.7 Q57.D
  Route2 0.7: v15.2,18.07 v15.2,19.32 | v20.6,18.07 v20.6,19.32 | v26,18.07 v26,19.32
  Route15 0.2: v11.6,9.7 11.6,10.1 10.5,11.2 10.5,14.1 9.4,15.2 9.4,17.3 JP1.3
  Route15 0.7: v15.2,18.07 v15.2,19.32 | v20.6,19.32 v20.6,18.07 | v26,18.07 v26,19.32
  pour Bottom (isolate 0.25, rank 5, no thermals): 8,19.6 26.3,19.6 26.3,17.8 8,17.8 arc-180
  pour Top: 14.95,17.75 14.95,19.65 15.65,19.65 15.65,17.75
  pour Top: 20.35,17.75 20.35,19.65 21.05,19.65 21.05,17.75
  pour Top: 25.75,17.75 25.75,19.65 26.45,19.65 26.45,17.75
  pour Top (no thermals): 8,18 8,19.4 10.7,19.4 10.7,18
C4+  (via drill 0.25)
  Top 0.25: Q4.1 30,5.8 29.6,5.4 29.4,5.4 29,5 Q4.4 29,4.58 28.6,4.17 v28.6,4 | Q3.1 15.9,8.2 15.5,7.8 15.3,7.8 14.9,7.4 Q3.4 v14.9,6.1
  Top 0.4: R4.1 13.1,6.1 13.1,5.25 D1.C 13.2,5 12.9,4.7 C1.1
  Top 0.55: v14,5.03 13.32,5.03 D1.C
  Bottom 0.3: v14,5.03 14.9,5.03 | 14.9,5.03 v14.9,6.1 | 14.9,5.03 15.72,4.2 22,4.2 22.3,3.9 22.9,3.9 23.1,4.1 24.3,4.1 24.5,3.9 28.5,3.9 v28.6,4
C4D
  Top 0.3: DA1.3 DA1.2 DA1.1 13.65,8.05 13.15,7.55 13.15,7.35 R4.2
  Top 0.4: R7.1 R4.2
C5  (via drill 0.25, 0.4)
  Top 0.3: v20.6,21.2 Q55.D | v10.1,25.3 11.2,25.3 11.6,25.7 11.6,26.2 12,26.6 DA2.5
  Top 0.7: v28.52,20.55 v27.98,20.88 v28.52,21.2 | v17.7,20.55 v17.15,20.88 v17.7,21.2
  Route2 0.7: v20.6,20.57 v20.6,21.82 | v17.7,21.2 v17.7,20.55 v17.15,20.88 v17.7,21.2 | v28.52,21.2 v28.52,20.55 v27.98,20.88 v28.52,21.2
  Route15 0.2: v10.1,25.3 10.4,25 10.4,24.1 9.4,23.1 9.4,22.6 JP1.2
  Route15 0.7: v20.6,21.82 v20.6,20.57 | v17.7,21.2 v17.7,20.55 v17.15,20.88 v17.7,21.2 | v28.52,21.2 v28.52,20.55 v27.98,20.88 v28.52,21.2
  pour Bottom (isolate 0.25, rank 5, no thermals): 8,22.1 28.8,22.1 28.8,20.3 8,20.3 arc-180
  pour Top: 20.35,20.25 20.35,21.95 20.55,22.15 21.05,22.15 21.05,20.25
  pour Top: 29.2,20.3 28.5,20.3 28.5,21.45 29.2,21.45
  pour Top: 18.4,20.3 17.68,20.3 17.68,21.45 18.4,21.45
  pour Top (no thermals): 8,20.5 8,21.9 10.7,21.9 10.7,20.5
C6  (via drill 0.25, 0.4)
  Top 0.3: DA2.6 12.2,25.95 12.2,24.3
  Top 0.55: v15,22.4 v15,23 15.57,23.57 DTVS.C
  Top 0.7: v21.88,23.93 v23.18,23.93
  Route2 0.55: v15,22.4 v15,23
  Route2 0.7: v21.88,23.93 v22.52,23.93 v23.18,23.93
  Route15 0.55: v15,22.4 v15,23
  Route15 0.7: v21.88,23.93 v22.52,23.93 v23.18,23.93
  Bottom 0.55: v15,22.4 v15,23
  pour Top (rank 5): 23.8,22.75 23.6,22.75 22.7,23.65 22.7,23.95 23.8,23.95
  pour Bottom (isolate 0.25, no thermals): 8,22.8 arc-180 8,24.6 14,24.6 14.6,24 16.7,24 17.3,24.6 23,24.6 arc-160 23.1,23.6 21.5,23.6 21.2,23.9 19,23.9 18,22.8
  pour Top (no thermals): 8,23 8,24.4 12.2,24.4 12.65,23.95 13,23.95 13,23
C6D
  Top 0.3: DA2.2 DA2.1 14.75,25.95 R5.1
EN_FLYBACK  (via drill 0.25)
  Top 0.2: U2.7 44.5,24.7 44.3,24.5 43.5,24.5 v43.4,24.6 41.85,24.6 R16.2
  Top 0.25: U1.4 36.2,27.8 v36.3,27.7
  Route15 0.2: v43.4,24.6 43,25 41.5,25 41.2,25.3 41.2,25.8 39.6,27.4 36.6,27.4 v36.3,27.7
FS
  Top 0.25: U1.5 35.2,28.3 35.2,28.7 34.77,29.12 34.67,29.12 R6.2
GATE  (via drill 0.25)
  Top 0.25: U1.6 32.15,28.3 v31.95,28.5
  Top 0.4: Q1.G 33.6,19.68 v33.6,19.9
  Route15 0.4: v33.6,19.9 32.7,20.8 32.7,27.75 v31.95,28.5
GS1  (via drill 0.25)
  Top 0.25: v17.4,9.5 17.2,9.5 16.4,8.7 16.4,7.1 | 15.9,7.03 Q3.6 16.4,7.1 | RGS1.2 16.7,6.8 16.4,7.1
  Top 0.35: v12.47,12.1 12.9,12.1 Q12.G
  Top 0.4: Q14.G v17.4,9.5
  Route15 0.2: 17.1,9.8 v17.4,9.5 17,9.9 17,11.1 15.65,12.45 12.82,12.45 v12.47,12.1
GS3  (via drill 0.25)
  Top 0.2: v18.8,26.6 18.8,26.7 19.3,27.2 21.1,27.2 22,26.3 U3.4
  Top 0.35: v12.2,15.3 11.78,15.3 Q31.G | v12.47,17.1 12.9,17.1 Q32.G | v17.88,14.6 18.3,14.6 Q34.G | v17.6,12.8 17.18,12.8 Q33.G
  Top 0.5: v18.8,26.6 RGS.7
  Route15 0.2: v12.2,15.3 12.7,15.3 13.05,14.95 16.95,14.95 17.3,14.6 v17.88,14.6 | 12.2,17.1 11.97,17.1 11.2,17.88 11.2,22.3 12.2,23.3 12.2,25.8 13.2,26.8 16.4,26.8 17.2,26 18.3,26 18.8,26.5 v18.8,26.6
  Route15 0.3: v12.2,15.3 12.2,17.1 v12.47,17.1 | v17.6,12.8 17.6,14.6 v17.88,14.6
GS4  (via drill 0.25)
  Top 0.2: RGS.6 19.75,25.85 19.75,25.65 20,25.4 21,25.4 21.4,25.8 23.2,25.8 U3.5
  Top 0.35: v12.2,17.8 11.78,17.8 Q41.G | v12.47,19.6 12.9,19.6 Q42.G | v17.6,15.3 17.18,15.3 Q43.G | v17.88,17.1 18.3,17.1 Q44.G
  Top 0.5: v19.6,26.6 RGS.6
  Route15 0.2: v17.88,17.1 17.3,17.1 16.95,17.45 13.05,17.45 12.7,17.8 v12.2,17.8 | 12.2,19.6 11.97,19.6 11.6,19.98 11.6,22.1 12.6,23.1 12.6,25.6 13.4,26.4 16.2,26.4 17,25.6 18.7,25.6 19.6,26.5 v19.6,26.6
  Route15 0.3: v12.2,17.8 12.2,19.6 v12.47,19.6 | v17.6,15.3 17.6,17.1 v17.88,17.1
GS5  (via drill 0.25)
  Top 0.2: v25.3,26.6 25.2,26.7 U3.10
  Top 0.35: v12.2,20.3 11.78,20.3 Q51.G | v12.47,22.1 12.9,22.1 Q52.G | v17.6,17.8 17.18,17.8 Q53.G | v17.88,19.6 18.3,19.6 Q54.G
  Top 0.5: v20.4,26.6 20.4,26.1 RGS.5
  Route15 0.2: 17.6,19.6 17.3,19.6 16,20.9 14.8,20.9 14.2,20.3 v12.2,20.3 | v12.47,22.1 13,22.62 13,25.4 13.6,26 16,26 16.8,25.2 19.1,25.2 20.4,26.5 v20.4,26.6 22.1,26.6 23,27.5 24.1,27.5 25,26.6 v25.3,26.6
  Route15 0.3: v12.2,20.3 12.47,20.3 v12.47,22.1 | v17.6,17.8 17.6,19.6 v17.88,19.6
GS6  (via drill 0.25)
  Top 0.2: U3.9 24.73,26.3 25.02,26 25.6,26 26.1,26.5 v26.1,26.6
  Top 0.35: v13.7,25.25 13.3,25.25 13,24.95 Q62.G | Q64.G 18.4,22.5 v18.3,22.6
  Top 0.4: RGS6.2 26.3,26.4 v26.1,26.6
  Route15 0.2: 18.3,24.8 19.3,24.8 20.5,26 25.6,26 26.1,26.5 v26.1,26.6 | v13.7,25.25 13.7,24.85 14.55,24 16.5,24 17.3,24.8 18.3,24.8 | v18.3,22.6 18.3,24.8
GS+2  (via drill 0.25)
  Top 0.2: v18,26.6 18,26.7 18.9,27.6 21.3,27.6 22.2,26.7 U3.3
  Top 0.25: Q3.5 15.4,6.6 v15.7,6.3
  Top 0.35: v12.2,12.8 11.78,12.8 Q21.G | v12.47,14.6 12.9,14.6 Q22.G
  Top 0.5: v18,26.6 18,26.1 RGS.8
  Route15 0.2: 12.2,14.6 11.97,14.6 10.8,15.78 10.8,22.5 11.8,23.5 11.8,26 13,27.2 16.6,27.2 17.2,26.6 v18,26.6 | v12.2,12.8 11.9,12.5 11.9,11.8 13.9,9.8 15.6,9.8 15.9,9.5 15.9,6.5 v15.7,6.3
  Route15 0.3: v12.2,12.8 12.2,14.6 v12.47,14.6
GS-2  (via drill 0.25)
  Top 0.25: Q23.G 17.02,10.35 17.02,10.03 16.8,9.8 15,9.8 14.6,9.4 14.6,8.9 14.9,8.6 Q3.3 14.9,8.1 RGS-2.2
  Top 0.35: v17.88,12.1 18.3,12.1 Q24.G | v17.6,10.3 17.18,10.3 Q23.G
  Route15 0.3: v17.6,10.3 17.6,11.82 v17.88,12.1
GT1  (via drill 0.25)
  Top 0.25: v30.4,4.1 30.4,4.17 30,4.58 Q4.6
  Top 0.3: RGT1.2 31,4.6 30.5,4.1 v30.4,4.1
  Top 0.35: v23.27,12.1 23.7,12.1 Q16.G | v28.68,9.6 29.1,9.6 Q18.G
  Route2 0.3: v30.4,4.1 30.4,7.88 v28.68,9.6
  Route15 0.2: v28.68,9.6 28.25,9.6 27.8,10.05 27.8,11 26.35,12.45 23.62,12.45 v23.27,12.1
GT3  (via drill 0.25)
  Top 0.2: 22,7.4 RGT.8 | U4.5 23.25,6.9 23.25,7.45 22.95,7.75 22.25,7.75 RGT.8 | RGT.8 22,7.75 21.65,7.75 21.3,8.1 21.3,9.4 v21.2,9.5
  Top 0.35: v23,15.3 22.57,15.3 Q35.G | v23.27,17.1 23.7,17.1 Q36.G | v28.4,12.8 27.98,12.8 Q37.G | v28.68,14.6 29.1,14.6 Q38.G
  Route15 0.2: v28.68,14.6 28.1,14.6 27.75,14.95 23.85,14.95 23.5,15.3 v23,15.3 22.3,14.6 22.3,12.3 21.4,11.4 21.4,9.8 21.2,9.6 v21.2,9.5
  Route15 0.3: v23,15.3 23.27,15.3 v23.27,17.1 | v28.4,12.8 28.4,14.6 v28.68,14.6
GT4  (via drill 0.25)
  Top 0.2: U4.10 24.4,5.1 24.1,4.8 23.2,4.8 23,4.6 v22.6,4.6
  Top 0.35: v23,17.8 22.57,17.8 Q45.G | v23.27,19.6 23.7,19.6 Q46.G | v28.4,15.3 27.98,15.3 Q47.G | v28.68,17.1 29.1,17.1 Q48.G
  Top 0.5: RGT.5 22.3,4.6 v22.6,4.6
  Route15 0.2: v28.68,17.1 28.1,17.1 27.75,17.45 23.85,17.45 23.5,17.8 v23,17.8 21.9,16.7 21.9,12.5 21,11.6 21,10.2 20.6,9.8 20.6,9.2 22.4,7.4 22.4,4.9 22.6,4.7 v22.6,4.6
  Route15 0.3: v23,17.8 23.27,17.8 v23.27,19.6 | v28.4,15.3 28.4,17.1 v28.68,17.1
GT5  (via drill 0.25)
  Top 0.2: U4.9 24,5.3 23.9,5.2 22.9,5.2 22.45,5.65 22.15,5.65 RGT.6
  Top 0.35: v23,20.3 22.57,20.3 Q55.G | v23.27,22.1 23.7,22.1 Q56.G | v28.4,17.8 27.98,17.8 Q57.G | v28.68,19.6 29.1,19.6 Q58.G
  Top 0.5: v21.4,5.8 RGT.6
  Route15 0.2: 28.4,19.6 28,20 23.8,20 23.5,20.3 v23,20.3 21.5,18.8 21.5,12.7 20.6,11.8 20.6,10.4 20.2,10 20.2,9 22,7.2 22,6.3 21.5,5.8 v21.4,5.8
  Route15 0.3: v23,20.3 23.27,20.3 v23.27,22.1 | v28.4,17.8 28.4,19.6 v28.68,19.6
GT6  (via drill 0.25)
  Top 0.2: Q66.G 23.88,24.57 23.88,24.82 24.15,25.1 25.5,25.1 25.8,24.8 v25.8,24.02 | U4.8 23,5.7 22.6,6.1 22.6,6.2 22.35,6.45 22.15,6.45 RGT.7
  Top 0.35: Q68.G 28.77,22 v28.68,22.1
  Top 0.5: v21.4,6.6 RGT.7
  Route15 0.2: 25.8,22.7 23,22.7 22.7,22.4 22.7,21.7 20.95,19.95 20.25,19.95 19.8,19.5 19.8,8.8 21.4,7.2 v21.4,6.6 | 25.8,22.7 28.07,22.7 v28.68,22.1 | v25.8,24.02 25.8,22.7
GT+2  (via drill 0.25)
  Top 0.2: U4.4 24,7.3 22.9,8.4 21.8,8.4 RGT+2.2
  Top 0.25: Q4.5 v29.5,4.1
  Top 0.3: v22,9.5 21.85,9.35 21.85,8.65 RGT+2.2
  Top 0.35: v23,12.8 22.57,12.8 Q25.G | v23.27,14.6 23.7,14.6 Q26.G
  Route15 0.2: v29.5,4.1 29,4.6 26.6,4.6 25.6,5.6 24.8,5.6 24.5,5.9 24.5,6.9 22,9.4 v22,9.5 22,9.6 21.8,9.8 21.8,11.2 22.7,12.1 22.7,12.5 v23,12.8
  Route15 0.3: v23,12.8 23,14.32 v23.27,14.6
GT-2  (via drill 0.25)
  Top 0.25: v28.9,6.8 29,6.7 Q4.3 29,5.8 RGT-2.2
  Top 0.35: v28.4,10.3 27.98,10.3 Q27.G | v28.68,12.1 29.1,12.1 Q28.G
  Route15 0.2: v28.9,6.8 28.9,6.9 29.3,7.3 29.3,9.9 28.9,10.3 v28.4,10.3
  Route15 0.3: v28.4,10.3 28.68,10.3 v28.68,12.1
I_SENSE  (via drill 0.25)
  Top 0.25: U1.9 31.8,26.8 v31.7,26.7
  Top 0.4: v28,27.4 R8.1
  Route15 0.2: v31.7,26.7 28.7,26.7 v28,27.4
I_TH
  Top 0.25: U1.2 D3.A
N$7
  pour Top (rank 2, no thermals): 48.1,16.8 48.1,19 43.3,19 40,15.7 40,12.6 36.7,9.3 36.7,7.1 38.3,7.1 43,11.8 43,16.2 43.6,16.8
N$10  (via drill 0.4)
  Route2 0.7: v43.9,16 v46.7,16 | v31.8,17.5 v33.2,17.5 v32.85,16.9 v32.15,16.9 v31.8,17.5
  Route15 0.7: v43.9,16 v46.7,16 | v31.8,17.5 v33.2,17.5 v32.85,16.9 v32.15,16.9 v31.8,17.5
  Bottom 0.3: v32.85,16.9 32.9,17.2
  Bottom 2: v46.7,16 v43.9,16 36.9,16 arc-35 34.9,16.6 arc35 32.9,17.2 32.2,17.2
  other vias: 32.5,17.5 44.6,16 45.3,16 46,16
  pour Top (no thermals): 43.5,13.4 43.5,16 43.8,16.3 46.9,16.3 47.6,15.6 48.1,15.6 48.1,13.4
  pour Top (rank 2, no thermals): 33.5,18.8 31.5,18.8 31.5,17.5 32,16.6 33,16.6 33.5,17.5
OC
  Top 0.25: U1.8 31.4,27.3 31.07,26.98 29.07,26.98 R9.1
S+  (via drill 0.4)
  Top 0.7: v14.88,24.73 15.22,24.73 | 15.22,24.73 v16.2,24.73 | v15.22,25.3 15.22,24.73
  Top 0.95: Q12.D Q22.D Q32.D Q42.D Q52.D Q62.D
  Route2 0.7: v14.88,24.73 15.22,24.73 | 15.22,24.73 v16.2,24.73 | 15.22,24.73 v15.22,25.3 | v36.8,22.4 v36.8,21 v36.8,20.3 v36.8,19.6 v36.8,22.4
  Route15 0.7: v14.88,24.73 15.22,24.73 | 15.22,24.73 v16.2,24.73 | 15.22,24.73 v15.22,25.3 | v36.8,22.4 v36.8,21 v36.8,20.3 v36.8,19.6 v36.8,22.4
  Bottom 0.8: J4.4 16.19,26
  Bottom 1.6: v36.8,19.6 v36.8,22.4
  other vias: 36.8,21.7 15.55,24.73
  pour Bottom (isolate 0.25, rank 3, no thermals): 15.4,24.2 31.4,24.2 33.1,22.5 34.1,22.5 35,21.6 36.8,21.6 36.8,23.1 36.4,23.1 35.2,24.3 34.2,24.3 32.5,26 15.4,26 arc180
  pour Top (no thermals): 35.9,24.6 35.9,20 34.9,19 34.9,16.8 39.5,16.8 39.5,20.2 36.7,23 36.7,24.6
  pour Top (no thermals): 13.8,23.3 13.8,24.7 14.07,24.98 15.5,24.98 15.5,24.5 14.3,23.3
S-  (via drill 0.25, 0.4)
  Top 0.7: v20.57,23.15 v19.27,23.15
  Top 0.95: Q64.D Q54.D Q44.D Q34.D Q24.D Q14.D
  other vias: 19.6,22.57 19.93,23.15 30.43,23.15 31,23.5 31,22.82 30.43,23.82 1.5,25.7 1.5,6.6 14.5,1.5 14.5,30.9 48.3,30.7 48.3,1.7 48.1,12.2 31.1,0.8 31.2,31.6 1.7,16.2 48.1,20.2 34.6,8.7 41.5,19.1 9.6,5.9 9.6,26.5
  pour Bottom (isolate 0.25, rank 2, no thermals): 19.7,22.3 31.02,22.3 31.4,22.68 31.4,23.6 30.8,24.2 30.3,24.2 29.9,23.8 19.7,23.8 arc180
  pour Top: 19.1,21.2 19.1,23.18 20.68,23.18 19.6,22.1 19.6,21.2
  pour Route2 (isolate 0.25, rank 6): 0,0 0,33.4 51,33.4 51,0
  pour Route15 (isolate 0.25, rank 6): 0,0 0,33.9 51.5,33.9 51.5,0
  pour Top (no thermals): 34.9,24.6 30.8,24.6 30.1,23.9 30.1,23 30.6,22.5 31.2,22.5 31.9,23.2 34.9,23.2
S-F  (via drill 0.25, 0.4)
  Top 0.2: U4.12 25.2,5.1 25.6,4.7 v25.6,4.6 | U3.12 24.8,27.5 v25.3,28 | U2.3 44.2,26.6
  Top 0.25: U1.10 33.4,26.3 v33.5,26.4 | U1.3 34.5,27.3 v34.5,26.4 | R6.1 v33.5,28.2
  Top 0.4: C2.1 30.5,26 32,26 32.23,26.23 33.33,26.23 v33.5,26.4 | R16.1 40,26.45 C8.1
  Top 0.5: v26.1,30.4 RA.8 RA.7 RA.6 RA.5 RA.4
  Top 0.7: v39.4,26.6 C8.1
  Route15 0.3: v25.6,4.6 26.1,4.1 27.4,4.1 28.2,3.3 30.7,3.3 31.9,4.5 34.3,4.5 42.1,12.3 42.1,15.9 46.9,20.7 47.3,20.7 | J2.3 44.37,3.3 46.9,3.3 47.4,3.8 47.4,12.5 48.7,13.8 48.7,18.6 47.3,20 47.3,20.7 | v47.4,24.2 47.3,24.1 47.3,20.7
  Route15 0.4: J3.2 45.4,28.07 v45.4,27.1 | v39.4,26.6 38.9,26.1 38,26.1 37.2,26.9 36.1,26.9 35.5,27.5 34.2,27.5 v33.5,28.2 32.3,29.4 29.5,29.4 29,28.9 26.2,28.9 v25.3,28
  Bottom 0.3: v47.4,24.2 47.2,24.2 45.6,25.8 | v25.3,28 26.1,28.8 v26.1,30.4
  Bottom 0.4: v39.4,26.6 41.9,26.6 42.2,26.3 44,26.3
  other vias: 44.4,26.1 34.5,28.2
  pour Top (no thermals): 43.9,25.8 45.7,25.8 45.7,27.4 43.9,27.4
  pour Bottom (isolate 0.25, rank 2, no thermals): 43.9,27.5 45.8,27.5 45.8,25.7 43.9,25.7
  pour Top: 33.33,26.23 33.3,28.4 34.7,28.4 34.7,26.2
  pour Bottom (isolate 0.25, no thermals): 32.8,26.4 32.8,29 35.2,29 35.2,26 33.2,26
SCL
  Top 0.2: J3.4 39.39,29 42,29 43.2,27.8 43.2,27.4 U2.1
SDA
  Top 0.2: U2.20 44.1,28.3 43.3,28.3 42.2,29.4 41.53,29.4 J3.3
SENSE  (via drill 0.25)
  Top 0.4: v27.4,25.9 R8.2 R9.2
  Top 0.6: v31.5,21.8 31.5,21.6 32.15,20.95 RSSENSE.2
  Route15 0.2: v31.5,21.8 30.6,21.8 27.4,25 v27.4,25.9
  pour Top (no thermals): 32.7,19.32 31.5,19.32 31.5,21.4 33.1,21.4 33.1,20.4 32.7,20
SS+2
  Top 0.3: Q21.S Q22.S
SS+3
  Top 0.3: Q31.S Q32.S
SS+4
  Top 0.3: Q41.S Q42.S
SS+5
  Top 0.3: Q51.S Q52.S
SS-2
  Top 0.3: Q23.S Q24.S
SS-3
  Top 0.3: Q33.S Q34.S
SS-4
  Top 0.3: Q43.S Q44.S
SS-5
  Top 0.3: Q53.S Q54.S
ST+2
  Top 0.3: Q25.S Q26.S
ST+3
  Top 0.3: Q35.S Q36.S
ST+4
  Top 0.3: Q45.S Q46.S
ST+5
  Top 0.3: Q55.S Q56.S
ST-2
  Top 0.3: Q27.S Q28.S
ST-3
  Top 0.3: Q37.S Q38.S
ST-4
  Top 0.3: Q47.S Q48.S
ST-5
  Top 0.3: Q57.S Q58.S
T+  (via drill 0.25, 0.4)
  Top 0.4: R2.2 32.1,7.2
  Top 0.7: v25,9.5 v23.65,9.5
  Top 0.95: Q66.D Q56.D Q46.D Q36.D Q26.D Q16.D
  Route2 0.7: v23.65,9.5 v25,9.5 | v31.3,7.8 v31.3,8.6 v32,8.6 v32,7.8 v31.3,7.8
  Route15 0.3: J2.1 32.9,2.2 v32.8,2.1 23.91,2.1 J1.4
  Route15 0.7: v23.65,9.5 v25,9.5 | v31.3,7.8 v31.3,8.6 v32,8.6 v32,7.8 v31.3,7.8
  Bottom 0.3: v32,7.8 32,7.6 32.8,6.8 v32.8,2.1
  other vias: 24.32,9.5
  pour Top (no thermals): 24.4,11.2 24.4,10 24.1,9.7 24.1,9.4 25.2,9.4 25.2,10.38 25.15,10.43 25.15,11.2
  pour Bottom (isolate 0.3, no thermals): 23.5,9.8 25.3,9.8 25.3,9.3 25.7,8.9 32.2,8.9 32.3,8.8 32.3,7.3 25.4,7.3 23.5,9.2
  pour Top (no thermals): 33.9,7.1 31,7.1 31,8.8 32.5,10.3 32.5,12.4 33.9,12.4
T-  (via drill 0.25)
  Top 0.3: Q18.D 30.52,8.38 30.52,7.08 31.1,6.5 R2.1 31.1,5.8 32.1,4.8 v32.1,3.8
  Top 0.4: 30.43,15.15 30.18,15.4
  Top 0.95: Q68.D Q58.D Q48.D Q38.D Q28.D Q18.D
  Route15 0.3: J1.3 22.47,3.4 24.3,3.4 25,2.7 32,2.7 32.1,2.8 | J2.2 39.63,3.3 37.7,3.3 37.2,2.8 32.1,2.8 | v32.1,3.8 32.1,2.8
  pour Top (no thermals): 39.5,13.4 30.2,13.4 30.2,15.6 39.5,15.6
TH  (via drill 0.25)
  Top 0.2: U2.10 45.7,25 v47.4,25
  Top 0.6: D3.C v38.4,26.8
  Bottom 0.3: J2.4 47.4,3.79 47.4,12.5 48.7,13.8 48.7,18.6 47.3,20 47.3,21.6 | 47.3,21.6 41.7,21.6 38.4,24.9 v38.4,26.8 | 47.3,21.6 48.2,22.5 48.2,24.4 47.6,25 v47.4,25

### Text on the board
bPlace: !RESET | TURBOfunction.com/fpv | LiPovsky / Balalaika | Proto-3 / 2017-xx-xx
tDocu: 5.0cm | 3.24cm